# Altium schematic sheet SC10033E1_3.SchDoc: Meter_2
size A3
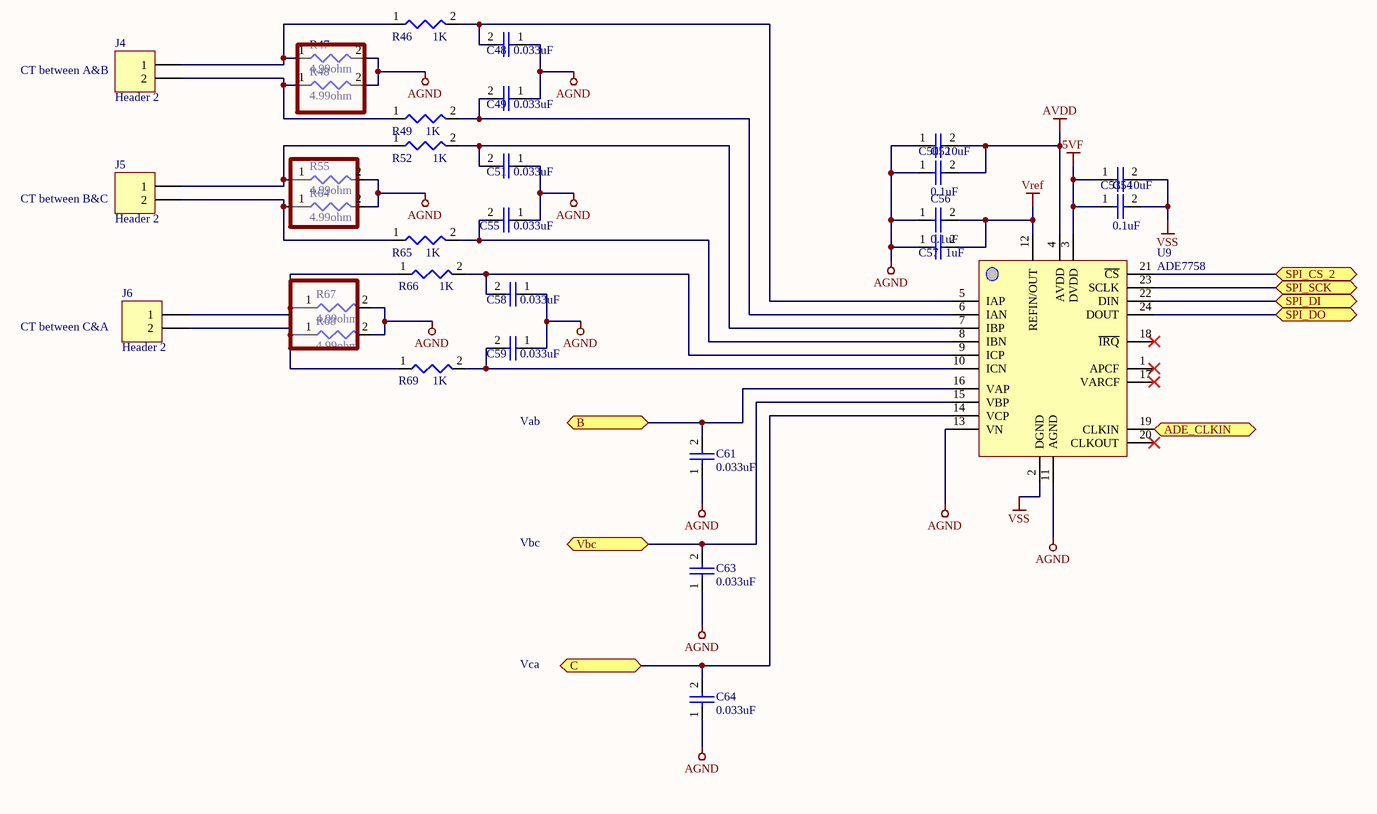
[diagram p0: SC10033E1_3.SchDoc]

## Parts
C48  value 0.033uF  [C0805]  (hidden comment: CAP)
C49  value 0.033uF  [C0805]  (hidden comment: CAP)
C50  10uF  [C0805]
C51  value 0.033uF  [C0805]  (hidden comment: CAP)
C52  value 0.1uF  [C0805]  (hidden comment: CAP)
C53  10uF  [C0805]
C54  value 0.1uF  [C0805]  (hidden comment: CAP)
C55  value 0.033uF  [C0805]  (hidden comment: CAP)
C56  value 0.1uF  [C0805]  (hidden comment: CAP)
C57  value 1uF  [C0805]  (hidden comment: CAP)
C58  value 0.033uF  [C0805]  (hidden comment: CAP)
C59  value 0.033uF  [C0805]  (hidden comment: CAP)
C61  value 0.033uF  [C0805]  (hidden comment: CAP)
C63  value 0.033uF  [C0805]  (hidden comment: CAP)
C64  value 0.033uF  [C0805]  (hidden comment: CAP)
J4  Header 2  [533980271_sd]
J5  Header 2  [533980271_sd]
J6  Header 2  [533980271_sd]
R46  value 1K  [R0805]  (hidden comment: RES)
R47  value 4.99ohm  [R0805]  (hidden comment: RES)
R48  value 4.99ohm  [R0805]  (hidden comment: RES)
R49  value 1K  [R0805]  (hidden comment: RES)
R52  value 1K  [R0805]  (hidden comment: RES)
R55  value 4.99ohm  [R0805]  (hidden comment: RES)
R64  value 4.99ohm  [R0805]  (hidden comment: RES)
R65  value 1K  [R0805]  (hidden comment: RES)
R66  value 1K  [R0805]  (hidden comment: RES)
R67  value 4.99ohm  [R0805]  (hidden comment: RES)
R68  value 4.99ohm  [R0805]  (hidden comment: RES)
R69  value 1K  [R0805]  (hidden comment: RES)
U9  ADE7758  [SOIC24-W]

## Ports
ADE_CLKIN (bidir), B, C, SPI_CS_2, SPI_DI, SPI_DO (bidir), SPI_SCK, Vbc

## Nets
5VF: C53.1 C54.1 U9.3(DVDD)
AGND: C48.1 C49.1 C50.1 C51.1 C52.1 C55.1 C56.1 C57.1 C58.1 C59.1 C61.1 C63.1 C64.1 R47.2 R48.2 R55.2 R64.2 R67.2 R68.2 U9.11(AGND) U9.13(VN)
AVDD: C50.2 C52.2 U9.4(AVDD)
Vref: C56.2 C57.2 U9.12(REFIN/OUT)
VSS: C53.2 C54.2 U9.2(DGND)
ADE_CLKIN: U9.19(CLKIN) ; port ADE_CLKIN
B: C61.2 U9.16(VAP) ; port B
C: C64.2 U9.14(VCP) ; port C
SPI_CS_2: U9.21(~{CS}) ; port SPI_CS_2
SPI_DI: U9.22(DIN) ; port SPI_DI
SPI_DO: U9.24(DOUT) ; port SPI_DO
SPI_SCK: U9.23(SCLK) ; port SPI_SCK
Vbc: C63.2 U9.15(VBP) ; port Vbc
NetC48_2: C48.2 R46.2 U9.5(IAP)
NetC49_2: C49.2 R49.2 U9.6(IAN)
NetC51_2: C51.2 R52.2 U9.7(IBP)
NetC55_2: C55.2 R65.2 U9.8(IBN)
NetC58_2: C58.2 R66.2 U9.9(ICP)
NetC59_2: C59.2 R69.2 U9.10(ICN)
NetJ4_1: J4.1 R46.1 R47.1
NetJ4_2: J4.2 R48.1 R49.1
NetJ5_1: J5.1 R52.1 R55.1
NetJ5_2: J5.2 R64.1 R65.1
NetJ6_1: J6.1 R66.1 R67.1
NetJ6_2: J6.2 R68.1 R69.1

Not connected (* = marked no-connect by the designer): U9 1(APCF)* 17(VARCF)* 18(~{IRQ})* 20(CLKOUT)*

## Notes on the sheet
- (near J4) CT between A&B
- (near J5) CT between B&C
- CT between C&A
- Vab
- Vbc
- Vca

## Library data of the parts
C48 C49 C51 C55 C58 C59 C61 C63 C64 = EC00079: CAP SMD X7R 50V 10% 0.033uF 0805 ROHS; Manufacturer: Murata; Manufacturer P/N: GRM219R71H333KA01; ID: 79; HelpURL: \\192.168.1.3\Esh\Department\RD\CAD\Component\Capacitor\smd\Murata_mpdf.pdf; P/N: EC00079
C50 C53 = EC00034: CAP SMD CR X5R 16V 10% 10uF 0805 ROHS; Manufacturer: Murata; Manufacturer P/N: GRM21BR61C106KE15; Value: 10uF_16V; ID: 34; Type: ****; HelpURL: *; P/N: EC00034
C52 C54 C56 = EC00014: CAP SMD CR X7R 50V 10% 0.1uF 0805 ROHS; Manufacturer: YAGEO; Manufacturer P/N: CC0805KRX7R9BB104; ID: 14; HelpURL: *; P/N: EC00014
C57 = EC00002: CAP SMD CR X7R 50V 10% 1uF 0805 ROHS; Manufacturer: YAGEO; Manufacturer P/N: CC0805KKX7R9BB105; ID: 2; HelpURL: *; P/N: EC00002
J4-J6 = EJ00039: CONNECTOR 1.25mm Pitch Header, Surface Mount, Vertical, Lead-Free, 2 Circuits; Manufacturer: MOLEX; ID: 39; Value: 533980271; HelpURL: \\192.168.1.3\Esh\Department\RD\CAD\Component\connector\molex\533980271_sd.pdf; P/N: EJ00039; Manufacturer P/N: 533980271
R46 R49 R52 R65 R66 R69 = ER00028: RES THICK_FILM SMD 1K 1% 1/8W ROHS 0805; Manufacturer: YAGEO; Manufacturer P/N: RC0805FR-071KL; ID: 28; HelpURL: *; P/N: ER00028
R47 R48 R55 R64 R67 R68 = ER00201: RES THIN_FILM SMD 4.99 ohm 0.1% 1/8W ±25ppm/℃ ROHS 0805; Manufacturer: YAGEO; Manufacturer P/N: RT0805BRD074R99L; ID: 201; HelpURL: *; P/N: ER00201
U9 = EU00042: IC Energy Measurement,Irms,VA,VAR,Vrms,Watt,Output:Pulsed&SPI,SOIC_W-24,ROHS; Manufacturer P/N: ADE7758ARWZRL; Manufacturer: ANALOG DEVICES; ID: 42; Value: ADE7758ARWZRL; HelpURL: \\192.168.1.3\Esh\Department\RD\CAD\Component\Energy Measurement\ADE7758.pdf; P/N: EU00042; Type: *****